# EAGLE design T07 411rev 4 (EAGLE 7.1.0)
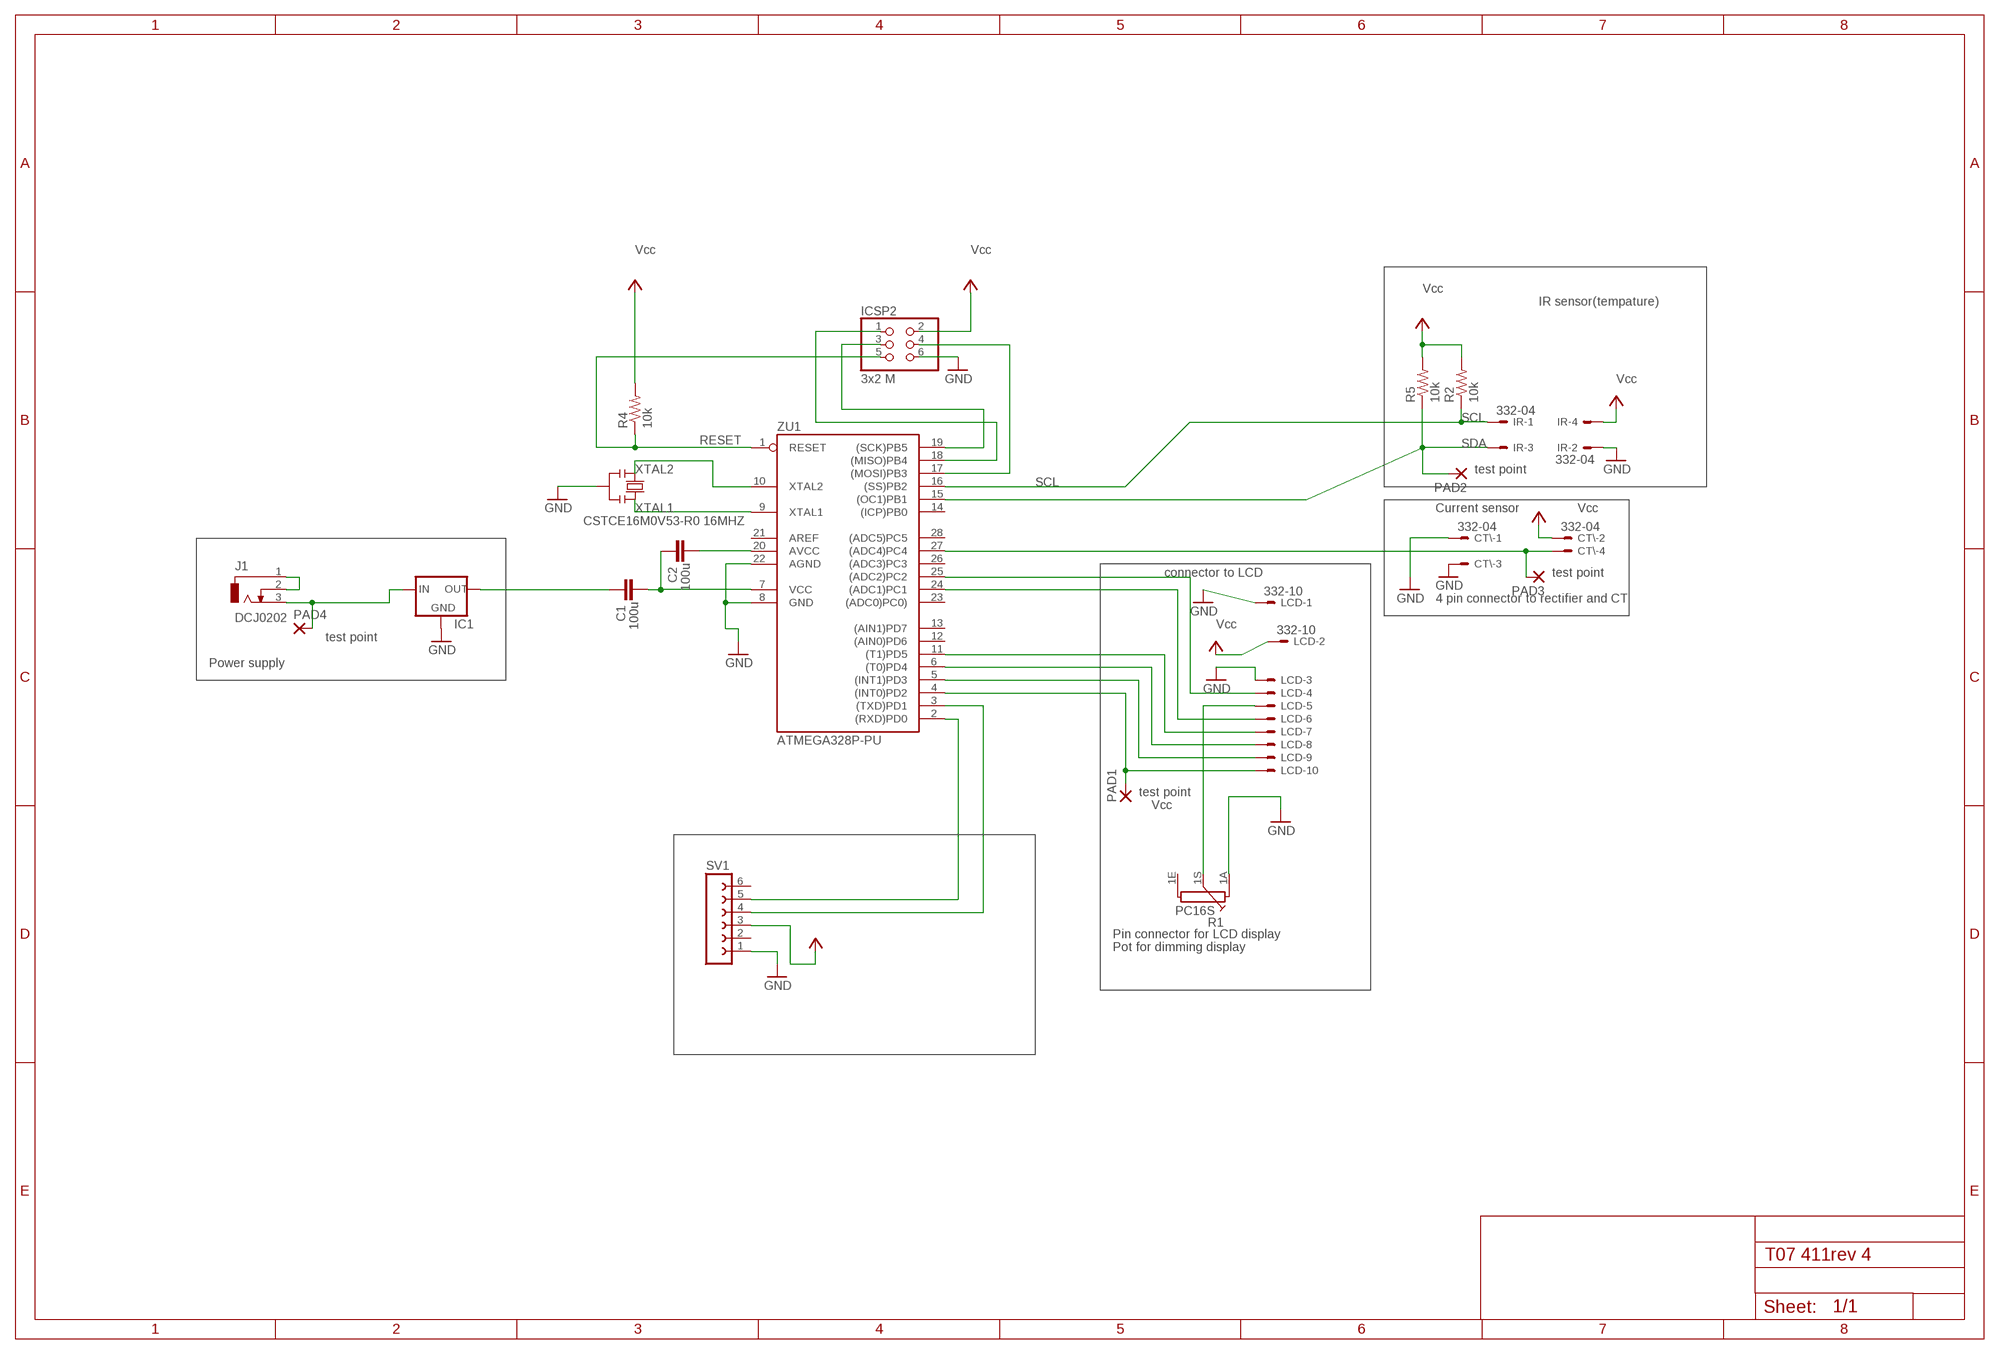
[diagram p0: schematic, sheet 1]

## Parts
C1  100u  C-EU0603-RND  [C0603-ROUND]
C2  100u  C-EU0603-RND  [C0603-ROUND]
CT\  332-04  [332-04]
IC1  78XXL  [78XXL]
ICSP2  3x2 M  PINHD-2X3  [2X03]
IR  332-04  [332-04]
J1  DCJ0202  [DCJ0202]
LCD  332-10  [332-10]
PAD1  1,6/0,9  [1,6/0,9]
PAD2  1,6/0,9  [1,6/0,9]
PAD3  1,6/0,9  [1,6/0,9]
PAD4  1,6/0,9  [1,6/0,9]
R1  PC16S  [PC16S]
R2  10k  RESISTOR0402-RES  [0402-RES]
R4  10k  RESISTOR0402-RES  [0402-RES]
R5  10k  RESISTOR0402-RES  [0402-RES]
SV1  FE06-1  [FE06]
Y3  CSTCE16M0V53-R0 16MHZ  RESONATORMU  [RESONATOR]
ZU1  ATMEGA328P-PU  [DIL28-3]

## Nets
+5V [usbvcc]: CT\.2 ICSP2.2 IR.4 LCD.2 R2.2 R4.2 R5.2 SV1.3
GND [gnd]: CT\.1 CT\.3 IC1.GND ICSP2.6 IR.2 LCD.1 LCD.3 R1.1A SV1.1 Y3.2 ZU1.8(GND) ZU1.22(AGND)
MISO1: ICSP2.1 ZU1.18((MISO)PB4)
MOSI1: ICSP2.4 ZU1.17((MOSI)PB3)
N$1: LCD.10 PAD1.1(P) ZU1.4((INT0)PD2)
N$2: LCD.9 ZU1.5((INT1)PD3)
N$3: LCD.8 ZU1.6((T0)PD4)
N$4: LCD.7 ZU1.11((T1)PD5)
N$5: LCD.6 ZU1.24((ADC1)PC1)
N$6: LCD.4 ZU1.25((ADC2)PC2)
N$7: LCD.5 R1.1S
N$8 [usbvcc]: C1.2 IC1.OUT
N$9 [usbvcc]: IC1.IN J1.3 PAD4.1(P)
N$10 [usbvcc]: C1.1 C2.2 ZU1.7(VCC)
N$11 [usbvcc]: C2.1 ZU1.20(AVCC)
N$13: CT\.4 PAD3.1(P) ZU1.27((ADC4)PC4)
N$14 [gnd]: J1.1 J1.2
N$17: SV1.4 ZU1.3((TXD)PD1)
N$18: SV1.5 ZU1.2((RXD)PD0)
RESET: ICSP2.5 R4.1 ZU1.1(RESET)
SCK1: ICSP2.3 ZU1.19((SCK)PB5)
SCL: IR.1 R2.1 ZU1.16((SS)PB2)
SDA: IR.3 PAD2.1(P) R5.1 ZU1.15((OC1)PB1)
XTAL1: Y3.3 ZU1.9(XTAL1)
XTAL2: Y3.1 ZU1.10(XTAL2)
Unconnected: R1.1E SV1.2 SV1.6 ZU1.12((AIN0)PD6) ZU1.13((AIN1)PD7) ZU1.14((ICP)PB0) ZU1.21(AREF) ZU1.23((ADC0)PC0)) ZU1.26((ADC3)PC3) ZU1.28((ADC5)PC5)

## Notes on the sheet
- Vcc | Vcc
- Vcc
- IR sensor(tempature)
- Vcc
- test point
- Current sensor | Vcc
- connector to LCD | test point
- 4 pin connector to rectifier and CT
- Vcc
- test point
- Power supply
- test point
- Vcc
- Pin connector for LCD display
- Pot for dimming display

## Library data of the parts
C1 C2 = SmartPrj:C-EU: CAPACITOR, European symbol
CT\ IR = con-garry:332-04: 4 Pin - 2mm Dual Row Source: www.mpe-connector.de / garry_shortform_2012.pdf
IC1 = v-reg:78XXL: VOLTAGE REGULATOR
ICSP2 = SmartPrj:PINHD-2X3: PIN HEADER
J1 = con-jack:DCJ0202: DC POWER JACK Source: DCJ0202.pdf; OC_FARNELL: unknown; OC_NEWARK: unknown
LCD = con-garry:332-10: 10 Pin - 2mm Dual Row Source: www.mpe-connector.de / garry_shortform_2012.pdf
PAD1-PAD4 = wirepad:1,6/0,9: THROUGH-HOLE PAD
R1 = piher:PC16S: POTENTIOMETER single carbon potentiometer, 16 mm, S3ROH; OC_FARNELL: 4452940; OC_NEWARK: unknown
R2 R4 R5 = SparkFun:RESISTOR: Resistor Basic schematic elements and footprints for 0603, 1206, and PTH 1/10th watt (small) resistors.
SV1 = con-lsta:FE06-1: FEMALE HEADER; OC_FARNELL: unknown; OC_NEWARK: unknown
Y3 = SmartPrj:RESONATOR
ZU1 = SmartPrj:ATMEGA328P-: MICROCONTROLLER 4 Kbytes FLASH 128 bytes SRAM 256 bytes EEPROM UART 6-channel 10 bit ADC

## Net classes
1 power: width 0.61 mm, drill 0.61 mm, clearance 0.254 mm
2 gnd: width 0.305 mm, drill 0.559 mm, clearance 0.254 mm
3 usbvcc: width 0.508 mm, drill 0.61 mm, clearance 0.254 mm
4 aref: width 0.406 mm, drill 0.61 mm, clearance 0.254 mm

## Board
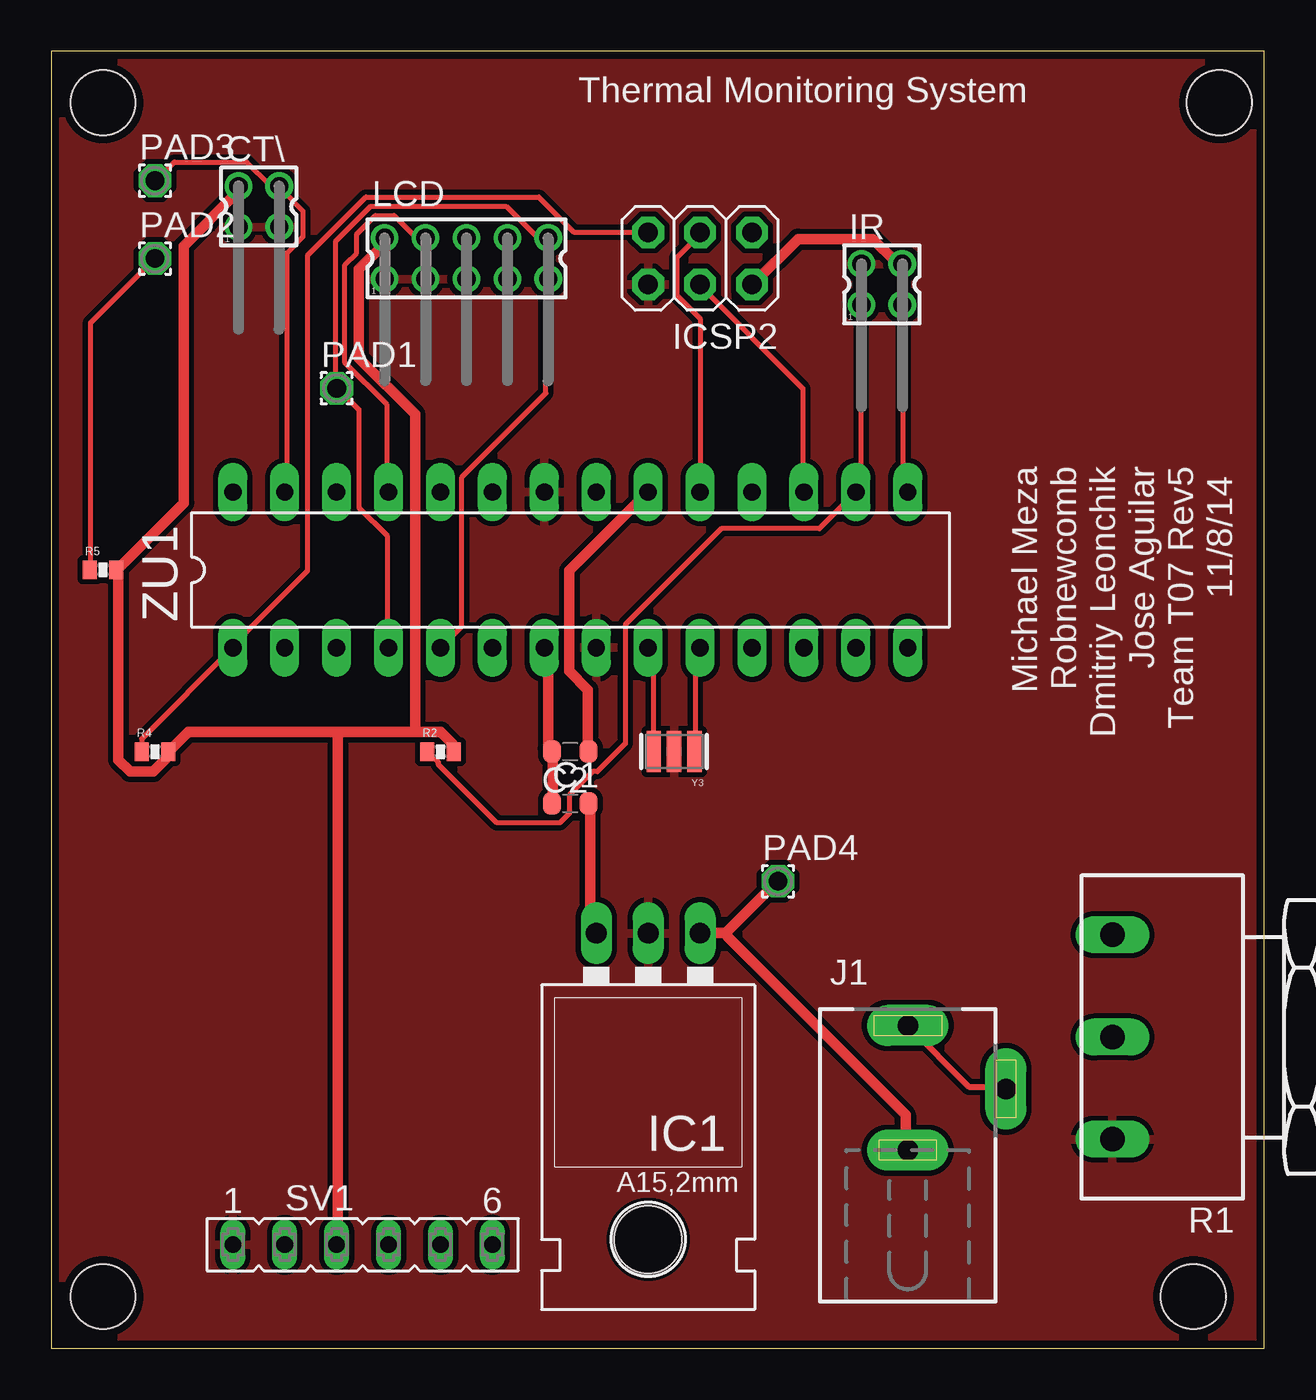
[diagram p1: board, top side]
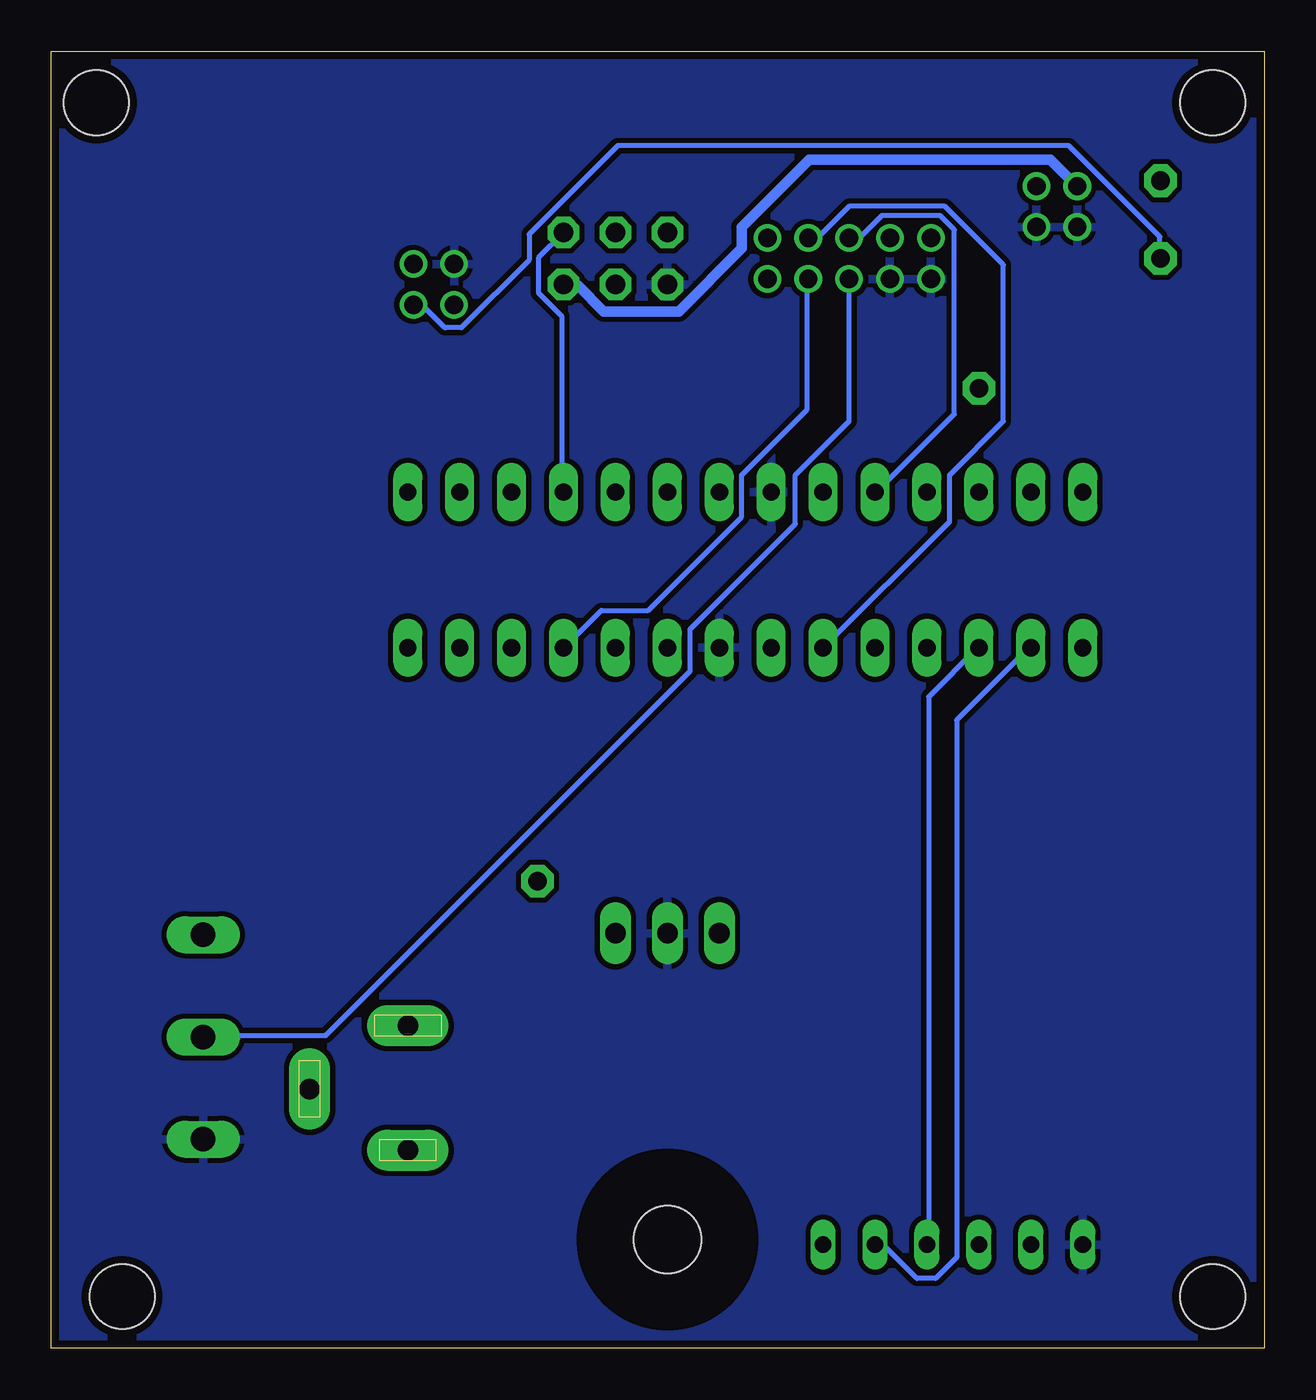
[diagram p2: board, bottom side, seen from below]

Size 59.36 x 63.49 mm. Coordinates in mm from the lower left corner, seen from the top.
Outline: 0,0 59.36,0 59.36,63.49 0,63.49 0,0
Copper layers (1*16): Top 0.0356mm / dielectric 1.5011mm / Bottom 0.0356mm
Design rules "OSH-Park-2-layer": minimum track width 6mil, minimum drill 13mil, track to track 6mil, track to pad 6mil, pad to pad 6mil, via to via 6mil, smd to smd 6mil, copper to edge 15mil, drill to drill 6mil, minimum pad ring 7mil, minimum via ring 7mil, stop-mask expansion 3mil, vias tented up to drill 0mil, thermal gap 10mil
Holes 3.17 mm at 2.54,2.54 55.88,2.54 57.15,60.96 2.54,60.96

### Footprints (pad centres in the part's own frame; a part is rotated, then mirrored left to right if it is on the bottom)
C0603-ROUND = smd 0.898 x 1.1: 1 -0.889,0; 2 0.889,0
332-04 = drill 0.9 pad 1.27: 1 -1,-1; 2 -1,1; 3 1,-1; 4 1,1
78XXL = drill 1.016 long: GND 0,-3.81; IN -2.54,-3.81; OUT 2.54,-3.81 | hole 3.302: 0,11.176
2X03 = drill 0.95 pad 1.55 octagon: 1 -2.54,-1.27; 2 -2.54,1.27; 3 0,-1.27; 4 0,1.27; 5 2.54,-1.27; 6 2.54,1.27
DCJ0202 = drill 1 pad 2 long: 1 0,3.1; 2 4.8,0; 3 0,-3
332-10 = drill 0.9 pad 1.27: 1 -4,-1; 2 -4,1; 3 -2,-1; 4 -2,1; 5 0,-1; 6 0,1; 7 2,-1; 8 2,1; 9 4,-1; 10 4,1
1,6/0,9 = drill 0.914 pad 1.6 octagon: 1 0,0
PC16S = drill 1.2 long: 1A -5,6.5; 1E 5,6.5; 1S 0,6.5
0402-RES = smd 0.7 x 0.9: 1 -0.65,0; 2 0.65,0
FE06 = drill 0.813 long: 1 -6.35,0; 2 -3.81,0; 3 -1.27,0; 4 1.27,0; 5 3.81,0; 6 6.35,0
RESONATOR = smd 0.7 x 2: 1 -1,0; 2 0,0; 3 1,0
DIL28-3 = drill 0.85 pad 1.422 long: 1 -16.51,-3.81; 2 -13.97,-3.81; 3 -11.43,-3.81; 4 -8.89,-3.81; 5 -6.35,-3.81; 6 -3.81,-3.81; 7 -1.27,-3.81; 8 1.27,-3.81; 9 3.81,-3.81; 10 6.35,-3.81; 11 8.89,-3.81; 12 11.43,-3.81; 13 13.97,-3.81; 14 16.51,-3.81; 15 16.51,3.81; 16 13.97,3.81; 17 11.43,3.81; 18 8.89,3.81; 19 6.35,3.81; 20 3.81,3.81; 21 1.27,3.81; 22 -1.27,3.81; 23 -3.81,3.81; 24 -6.35,3.81; 25 -8.89,3.81; 26 -11.43,3.81; 27 -13.97,3.81; 28 -16.51,3.81

### Placement (x,y rotation side)
C1  25.4,26.67 0 top
C2  25.4,29.21 180 top
CT\  10.16,55.88 0 top
IC1  29.21,16.51 180 top
ICSP2  31.75,53.34 180 top
IR  40.64,52.07 0 top
J1  41.91,12.7 0 top
LCD  20.32,53.34 0 top
PAD1  13.97,46.99 0 top
PAD2  5.08,53.34 0 top
PAD3  5.08,57.15 0 top
PAD4  35.56,22.86 0 top
R1  58.42,15.24 90 top
R2  19.05,29.21 0 top
R4  5.08,29.21 0 top
R5  2.54,38.1 0 top
SV1  15.24,5.08 0 top
Y3  30.48,29.21 180 top
ZU1  25.4,38.1 0 top

### Tracks (layer width: path | path; a pad name or v marks a point on that pad's centre or on a via)
+5V
  Top 0.508: IR.4 41.58,53.15 41.35,53.15 40.21,54.29 36.55,54.29 34.38,52.12 ICSP2.2 | 14.03,30.18 6.72,30.18 5.92,29.38 R4.2 5.69,29.15 5.69,28.92 5,28.23 3.86,28.23 3.29,28.8 3.29,38.06 R5.2 3.4,38.29 6.49,41.38 6.49,53.95 9.12,56.58 9.12,56.81 CT\.2 | 14.03,30.18 17.8,30.18 | 17.8,30.18 19.06,30.18 19.63,29.6 19.63,29.26 R2.2 | 14.03,30.18 14.03,5.14 SV1.3 | 17.8,30.18 17.8,45.72 15.06,48.46 15.06,52.81 16.32,54.06 16.32,54.29 LCD.2
  Bottom 0.508: ICSP2.2 34.27,52.01 33.58,52.01 32.32,50.75 28.66,50.75 25.58,53.84 25.58,54.86 22.26,58.18 10.49,58.18 9.23,56.92 CT\.2
GND
  pour Bottom (isolate 0.254): -38.1,81.28 66.04,81.28 66.04,-1.27 -39.37,-1.27 -39.37,81.28
  pour Top: -38.1,81.28 64.77,81.28 64.77,-1.27 -38.1,-1.27
  pour Bottom (isolate 0.254): -38.1,80.01 -38.1,-1.27 64.77,-1.27 64.77,81.28 -38.1,81.28
MISO1
  Bottom 0.254: ICSP2.1 35.52,53.38 35.52,51.66 34.38,50.52 34.38,41.95 ZU1.18
MOSI1
  Top 0.254: ZU1.17 36.78,41.95 36.78,46.98 31.75,52.01 ICSP2.4
N$1
  Top 0.254: LCD.10 24.21,54.41 23.75,54.41 22.26,55.89 15.63,55.89 13.92,54.18 13.92,47.09 PAD1.1 14.03,46.98 15.06,45.95 15.06,41.15 16.43,39.78 16.43,34.29 ZU1.4
N$2
  Top 0.254: LCD.9 24.21,52.23 24.21,46.75 20.09,42.63 20.09,35.32 19.06,34.29 ZU1.5
N$3
  Bottom 0.254: LCD.8 22.26,54.41 21.81,54.41 20.32,55.89 15.63,55.89 12.78,53.03 12.78,45.38 15.41,42.75 15.41,40.46 21.58,34.29 ZU1.6
N$4
  Bottom 0.254: LCD.7 22.38,52.23 22.38,45.95 25.58,42.75 25.58,40.69 30.15,36.12 32.44,36.12 34.27,34.29 ZU1.11
N$5
  Bottom 0.254: LCD.6 20.32,54.41 19.75,54.41 18.72,55.44 15.86,55.44 15.18,54.75 15.18,45.72 18.95,41.95 ZU1.24
N$6
  Top 0.254: LCD.4 18.26,54.41 17.8,54.41 16.78,55.44 15.86,55.44 14.95,54.52 14.95,53.61 14.38,53.03 14.38,48.23 16.43,46.18 16.43,41.95 ZU1.25
N$7
  Bottom 0.254: LCD.5 20.32,45.38 22.95,42.75 22.95,40.35 28.09,35.2 28.09,33.15 45.92,15.32 51.83,15.32 R1.1S
N$8
  Top 0.508: C1.2 26.38,26.63 26.38,20.57 26.61,20.34 IC1.OUT
N$9
  Top 0.508: 33.01,20.34 31.75,20.34 IC1.IN | 33.01,20.34 35.52,22.86 PAD4.1 | J1.3 41.81,9.72 41.81,11.43 33.12,20.12 33.01,20.34
N$10
  Top 0.508: C1.1 24.55,26.75 24.55,29.15 C2.2 24.32,29.38 24.32,34.18 24.21,34.29 ZU1.7
N$11
  Top 0.508: C2.1 26.26,29.26 26.26,32.23 25.35,33.15 25.35,38.06 29.12,41.83 ZU1.20
N$13
  Top 0.254: PAD3.1 5.12,57.15 6.03,58.06 9.58,58.06 10.72,56.92 11.06,56.92 CT\.4 11.18,56.81 12.32,55.66 12.32,54.41 11.52,53.61 11.52,41.95 ZU1.27
N$14
  Top 0.305: J1.2 46.61,12.8 44.89,12.8 41.92,15.77 J1.1
N$17
  Bottom 0.254: SV1.4 16.43,5.14 16.43,31.89 14.03,34.29 ZU1.3
N$18
  Bottom 0.254: SV1.5 18.95,5.03 18.61,5.03 17.01,3.43 16.09,3.43 15.06,4.46 15.06,30.75 11.52,34.29 ZU1.2
RESET
  Top 0.254: R4.1 4.43,29.26 4.43,29.83 ZU1.1 8.89,34.4 12.55,38.06 12.55,53.49 15.41,56.35 23.86,56.35 25.58,54.63 29.12,54.63 ICSP2.5
SCK1
  Top 0.254: ZU1.19 31.75,50.41 30.61,51.55 30.61,53.38 31.75,54.52 ICSP2.3
SCL
  Top 0.254: R2.1 18.49,29.15 18.95,28.69 18.95,28.57 21.81,25.72 24.89,25.72 25.35,26.18 25.35,27.09 26.49,28.23 26.72,28.23 28.09,29.6 28.09,35.43 32.78,40.12 37.58,40.12 ZU1.16 39.64,42.18 39.64,50.98 IR.1
SDA
  Top 0.254: IR.3 41.69,50.98 41.69,42.06 41.81,41.95 ZU1.15 | PAD2.1 1.92,50.18 1.92,38.18 R5.1
  Bottom 0.254: IR.3 41.58,50.98 41.12,50.98 40.09,49.95 39.29,49.95 35.98,53.26 35.98,54.52 31.64,58.86 9.58,58.86 5.12,54.41 5.12,53.38 PAD2.1
XTAL1
  Top 0.254: Y3.3 29.46,29.26 29.46,34.06 29.23,34.29 ZU1.9
XTAL2
  Top 0.254: ZU1.10 31.52,34.06 31.52,29.26 Y3.1

### Text on the board
tPlace: Thermal Monitoring System | Michael Meza / Robnewcomb / Dmitriy Leonchik / Jose Aguilar / Team T07 Rev5 / 11/8/14